# EAGLE design IMU (EAGLE 9.6.2)
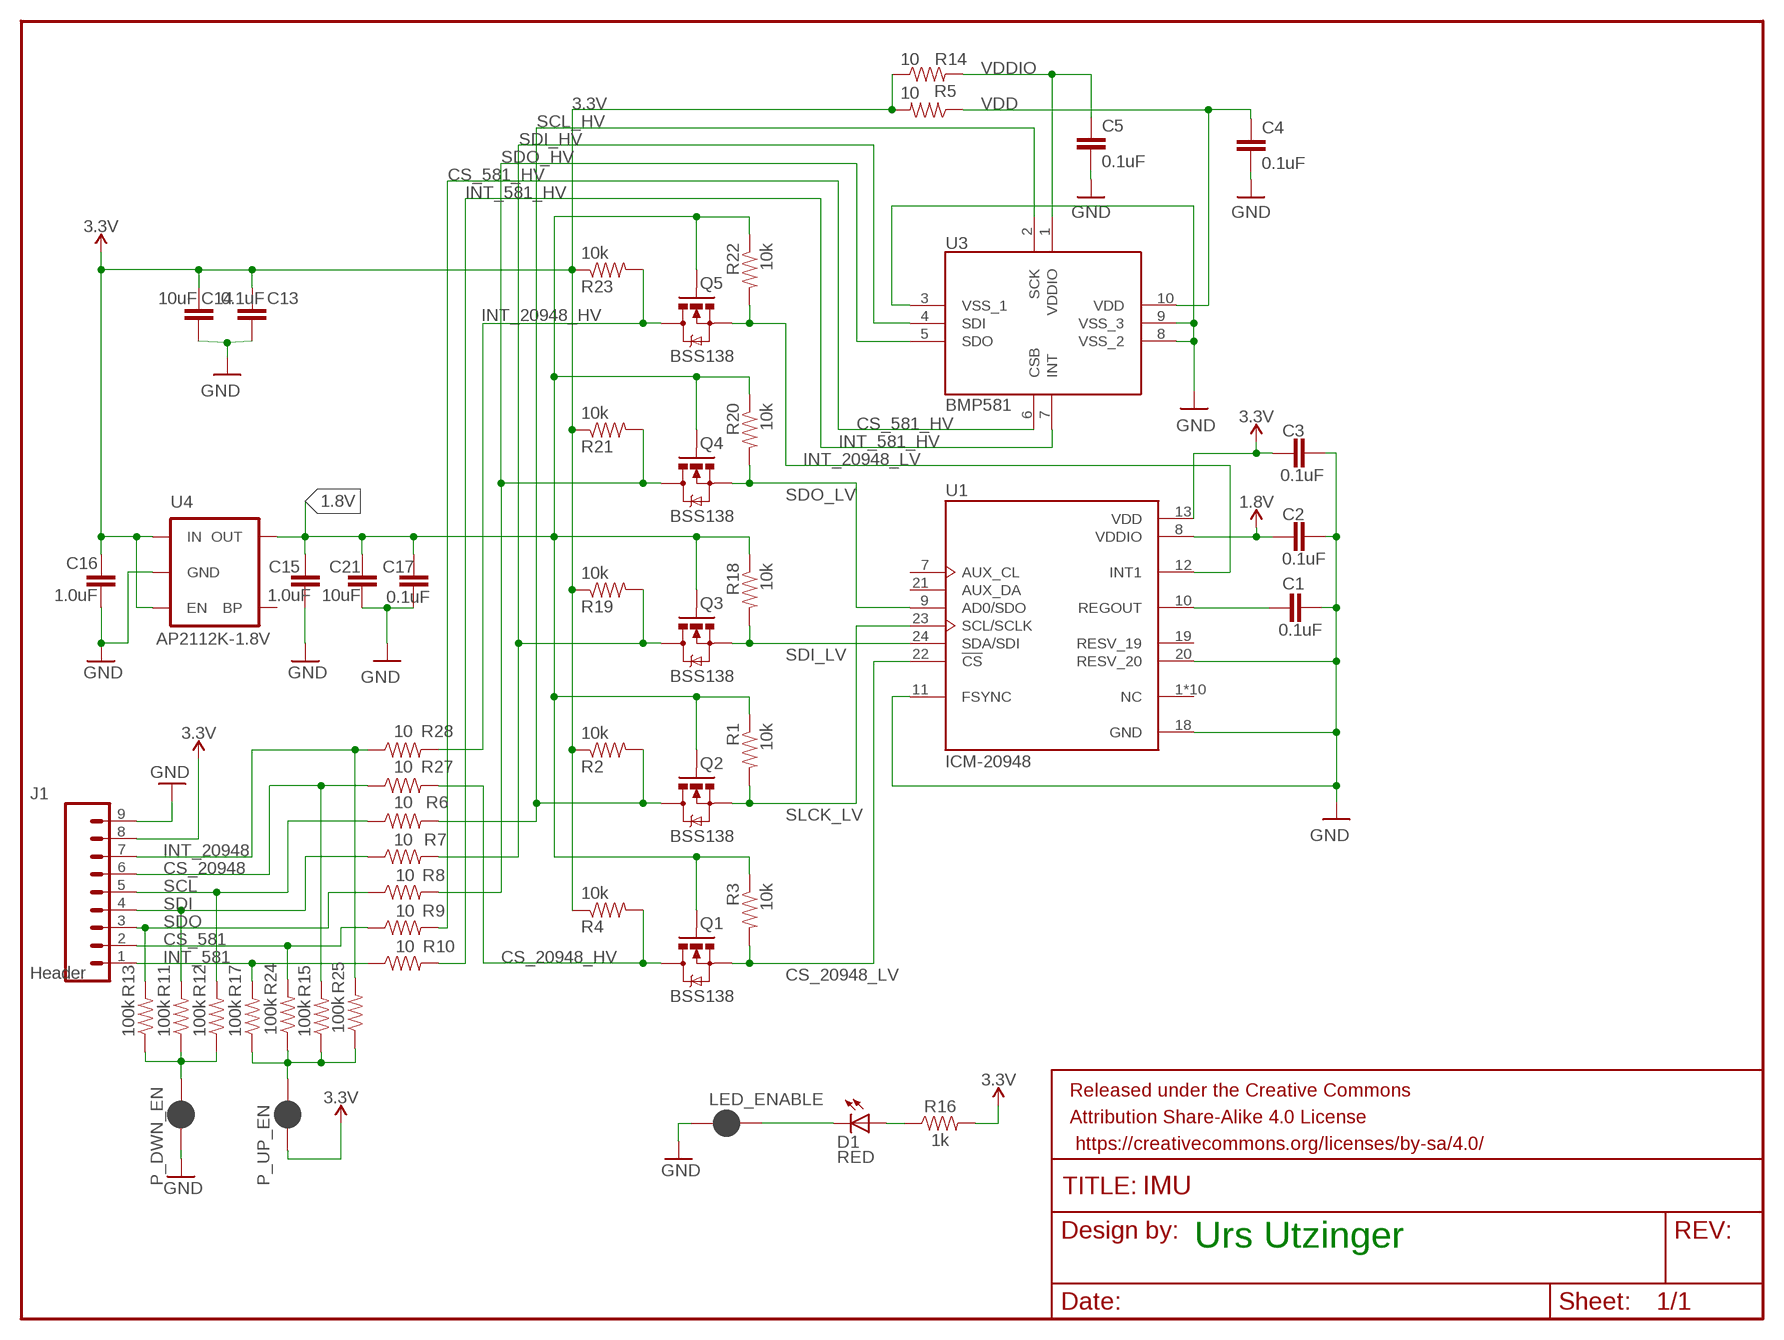
[diagram p0: schematic, sheet 1]

## Parts
C1  0.1uF  0.1UF-0603-25V-(+80/-20%)  [0603]
C2  0.1uF  0.1UF-0603-25V-(+80/-20%)  [0603]
C3  0.1uF  0.1UF-0603-25V-(+80/-20%)  [0603]
C4  0.1uF  0.1UF-0603-25V-(+80/-20%)  [0603]
C5  0.1uF  0.1UF-0603-25V-(+80/-20%)  [0603]
C13  0.1uF  0.1UF-0603-25V-(+80/-20%)  [0603]
C14  10uF  10UF-0603-6.3V-20%  [0603@1]
C15  1.0uF  1.0UF-0603-16V-10%  [0603]
C16  1.0uF  1.0UF-0603-16V-10%  [0603]
C17  0.1uF  0.1UF-0603-25V-(+80/-20%)  [0603]
C21  10uF  10UF-0603-6.3V-20%  [0603@1]
D1  RED  LED-RED0603  [LED-0603]
FRAME1  FRAME-LETTERNO_PACKAGE  [DUMMY]
J1  Header  CONN_09  [1X09]
LED_ENABLE  LED ENABLE  JUMPER-SMT_2_NC_PASTE_SILK  [SMT-JUMPER_2_NC_PASTE_SILK]
P_DWN_EN  JUMPER-SMT_2_NC_PASTE_SILK  [SMT-JUMPER_2_NC_PASTE_SILK]
P_UP_EN  JUMPER-SMT_2_NC_PASTE_SILK  [SMT-JUMPER_2_NC_PASTE_SILK]
Q1  BSS138  SPARKFUN_MOSFET-NCHANNELSMD  [SPARKFUN_SOT23-3]
Q2  BSS138  SPARKFUN_MOSFET-NCHANNELSMD  [SPARKFUN_SOT23-3]
Q3  BSS138  SPARKFUN_MOSFET-NCHANNELSMD  [SPARKFUN_SOT23-3]
Q4  BSS138  SPARKFUN_MOSFET-NCHANNELSMD  [SPARKFUN_SOT23-3]
Q5  BSS138  SPARKFUN_MOSFET-NCHANNELSMD  [SPARKFUN_SOT23-3]
R1  10k  10KOHM-0603-1/10W-1%  [0603]
R2  10k  10KOHM-0603-1/10W-1%  [0603]
R3  10k  10KOHM-0603-1/10W-1%  [0603]
R4  10k  10KOHM-0603-1/10W-1%  [0603]
R5  10  10OHM-0603-1/10W-5%  [0603]
R6  10  10OHM-0603-1/10W-1%  [0603]
R7  10  10OHM-0603-1/10W-1%  [0603]
R8  10  10OHM-0603-1/10W-1%  [0603]
R9  10  10OHM-0603-1/10W-1%  [0603]
R10  10  10OHM-0603-1/10W-1%  [0603]
R11  100k  100KOHM-0603-1/10W-1%  [0603]
R12  100k  100KOHM-0603-1/10W-1%  [0603]
R13  100k  100KOHM-0603-1/10W-1%  [0603]
R14  10  10OHM-0603-1/10W-5%  [0603]
R15  100k  100KOHM-0603-1/10W-1%  [0603]
R16  1k  1KOHM-0603-1/10W-1%  [0603]
R17  100k  100KOHM-0603-1/10W-1%  [0603]
R18  10k  10KOHM-0603-1/10W-1%  [0603]
R19  10k  10KOHM-0603-1/10W-1%  [0603]
R20  10k  10KOHM-0603-1/10W-1%  [0603]
R21  10k  10KOHM-0603-1/10W-1%  [0603]
R22  10k  10KOHM-0603-1/10W-1%  [0603]
R23  10k  10KOHM-0603-1/10W-1%  [0603]
R24  100k  100KOHM-0603-1/10W-1%  [0603]
R25  100k  100KOHM-0603-1/10W-1%  [0603]
R27  10  10OHM-0603-1/10W-1%  [0603]
R28  10  10OHM-0603-1/10W-1%  [0603]
U1  ICM-20948  [QFN40P300X300X105-24N]
U3  BMP581  [BMP581]
U4  AP2112K-1.8V  V_REG_LDOSMD  [SOT23-5]

## Nets
1.8V: C2.1 C15.2 C17.1 C21.1 Q1.1(G) Q2.1(G) Q3.1(G) Q4.1(G) Q5.1(G) R1.1 R3.1 R18.1 R20.1 R22.1 U1.8(VDDIO) U4.5(OUT)
3.3V: C3.1 C13.1 C14.1 C16.2 J1.8 P_UP_EN.1 R2.1 R4.1 R5.2 R14.1 R16.2 R19.1 R21.1 R23.1 U1.13(VDD) U4.1(IN) U4.3(EN)
CS_581: J1.2 R9.1 R24.2
CS_581_HV: R9.2 U3.6(CSB)
CS_20948: J1.6 R15.2 R27.1
CS_20948_HV: Q1.3(D) R4.2 R27.2
CS_20948_LV: Q1.2(S) R3.2 U1.22(!CS)
GND: C1.2 C2.2 C3.2 C4.2 C5.2 C13.2 C14.2 C15.1 C16.1 C17.2 C21.2 J1.9 LED_ENABLE.1 P_DWN_EN.1 U1.11(FSYNC) U1.18(GND) U1.20(RESV_20) U3.3(VSS_1) U3.8(VSS_2) U3.9(VSS_3) U4.2(GND)
INT_581: J1.1 R10.1 R17.2
INT_581_HV: R10.2 U3.7(INT)
INT_20948: J1.7 R25.2 R28.1
INT_20948_HV: Q5.3(D) R23.2 R28.2
INT_20948_LV: Q5.2(S) R22.2 U1.12(INT1)
N$3: C1.1 U1.10(REGOUT)
N$26: D1.A R16.1
N$28: D1.C LED_ENABLE.2
N$29: P_DWN_EN.2 R11.1 R12.1 R13.1
N$30: P_UP_EN.2 R15.1 R17.1 R24.1 R25.1
SCL: J1.5 R6.1 R12.2
SCL_HV: Q2.3(D) R2.2 R6.2 U3.2(SCK)
SDI: J1.4 R7.1 R11.2
SDI_HV: Q3.3(D) R7.2 R19.2 U3.4(SDI)
SDI_LV: Q3.2(S) R18.2 U1.24(SDA/SDI)
SDO: J1.3 R8.1 R13.2
SDO_HV: Q4.3(D) R8.2 R21.2 U3.5(SDO)
SDO_LV: Q4.2(S) R20.2 U1.9(AD0/SDO)
SLCK_LV: Q2.2(S) R1.2 U1.23(SCL/SCLK)
VDD: C4.1 R5.1 U3.10(VDD)
VDDIO: C5.1 R14.2 U3.1(VDDIO)
Unconnected: U1.1(NC) U1.2(NC) U1.3(NC) U1.4(NC) U1.5(NC) U1.6(NC) U1.7(AUX_CL) U1.14(NC) U1.15(NC) U1.16(NC) U1.17(NC) U1.19(RESV_19) U1.21(AUX_DA) U4.4(BP)

## Notes on the sheet
- Urs Utzinger

## Library data of the parts
C1-C5 C13 C17 = SparkFun-Capacitors:0.1UF: 0.1µF ceramic capacitors A capacitor is a passive two-terminal electrical component used to store electrical energy temporarily in an electric field.; PROD_ID: CAP-00810
C14 C21 = SparkFun-Capacitors:10UF: 10.0µF ceramic capacitors A capacitor is a passive two-terminal electrical component used to store electrical energy temporarily in an electric field.; PROD_ID: CAP-11015
C15 C16 = SparkFun-Capacitors:1.0UF: 1µF ceramic capacitors A capacitor is a passive two-terminal electrical component used to store electrical energy temporarily in an electric field.; PROD_ID: CAP-00868
D1 = SparkFun-LED:LED-RED: Assorted Red LEDs LilyPad 1206- DIO-09912 1206- DIO-00809 0603- DIO-00819; PROD_ID: DIO-00819
FRAME1 = SparkFun-Aesthetics:FRAME-LETTER: Schematic Frame - Letter Standard 8.5x11 US Letter frame; DESIGNER: Nobody; VERSION: v01
J1 = SparkFun-Connectors:CONN_09: Multi connection point. Often used as Generic Header-pin footprint for 0.1 inch spaced/style header connections On any of the 0.1 inch spaced packages, you can populate with these: Break Away Headers - Straight <https://www.sparkfun.com/products/116> (PRT-00116) Break Away Male Headers - Right Angle <https://www.sparkfun.com/products/553> (PRT-00553) Female Headers <https://www.sparkfun.com/products/115> (PRT-00115) Break Away Headers - Machine Pin <https://www.sparkfun.com/products/117> (PRT-00117) Break Away Female Headers - Swiss Machine Pin <https://www.sparkfun.com/products/743> (PRT-00743) For SCREWTERMINALS and SPRING TERMINALS visit here: Screw Terimnals on SparkFun.com <https://www.sparkfun.com/search/results?term=Screw+Terminals> (5mm/3.5mm/2.54mm spacing) This device is also useful as a general connection point to wire up your design to another part of your project. Our various solder wires solder well into these plated through hole pads. Hook-Up Wire - Assortment (Stranded, 22 AWG) <https://www.sparkfun.com/products/11375> (PRT-11375) Hook-Up Wire - Assortment (Solid Core, 22 AWG) <https://www.sparkfun.com/products/11367> (PRT-11367) View the entire wire category on our website here <https://www.sparkfun.com/categories/141> Special notes: Molex polarized connector foot print use with SKU : PRT-08231 with associated crimp pins and housings. 1MM SMD Version SKU: PRT-10208 NOTES ON THE VARIANTS LOCK and LOCK_LONGPADS... This footprint was designed to help hold the alignment of a through-hole component (i.e. 6-pin header) while soldering it into place. You may notice that each hole has been shifted either up or down by 0.005 of an inch from it's more standard position (which is a perfectly straight line). This slight alteration caused the pins (the squares in the middle) to touch the edges of the holes. Because they are alternating, it causes a "brace" to hold the component in place. 0.005 has proven to be the perfect amount of "off-center" position when using our standard breakaway headers. Although looks a little odd when you look at the bare footprint, once you have a header in there, the alteration is very hard to notice. Also,if you push a header all the way into place, it is covered up entirely on the bottom side.
LED_ENABLE P_DWN_EN P_UP_EN = SparkFun-Jumpers:JUMPER-SMT_2_NC_PASTE: Normally closed solder jumper This jumper has an aperture in the stencil to allow solder paste to bridge the split in the wire so it's normally closed (NC). Wick off the solder to open the connection. Reapply solder to reclose the connection.
Q1-Q5 = BSS138:SPARKFUN_MOSFET-NCHANNEL
R1-R4 R18-R23 = SparkFun-Resistors:10KOHM: 10kΩ resistor A resistor is a passive two-terminal electrical component that implements electrical resistance as a circuit element. Resistors act to reduce current flow, and, at the same time, act to lower voltage levels within circuits. - Wikipedia; PROD_ID: RES-00824
R5 R14 = SparkFun-Resistors:10OHM: 10Ω resistor A resistor is a passive two-terminal electrical component that implements electrical resistance as a circuit element. Resistors act to reduce current flow, and, at the same time, act to lower voltage levels within circuits. - Wikipedia; PROD_ID: RES-09834
R6-R10 R27 R28 = SparkFun-Resistors:10OHM: 10Ω resistor A resistor is a passive two-terminal electrical component that implements electrical resistance as a circuit element. Resistors act to reduce current flow, and, at the same time, act to lower voltage levels within circuits. - Wikipedia; PROD_ID: RES-12581
R11-R13 R15 R17 R24 R25 = SparkFun-Resistors:100KOHM: 100kΩ resistor A resistor is a passive two-terminal electrical component that implements electrical resistance as a circuit element. Resistors act to reduce current flow, and, at the same time, act to lower voltage levels within circuits. - Wikipedia; PROD_ID: RES-07828
R16 = SparkFun-Resistors:1KOHM: 1kΩ resistor A resistor is a passive two-terminal electrical component that implements electrical resistance as a circuit element. Resistors act to reduce current flow, and, at the same time, act to lower voltage levels within circuits. - Wikipedia; PROD_ID: RES-07856
U1 = ICM-20948:ICM-20948: Accelerometer, Gyroscope, Magnetometer, 9 Axis Sensor I²C, SPI Output; MANUFACTURER: TDK InvenSense; MAXIMUM_PACKAGE_HEIGHT: 1.05 mm; PARTREV: 1.3; STANDARD: IPC 7351B
U3 = BMP581:BMP581: Pressure Sensor 4.35PSI ~ 18.13PSI (30kPa ~ 125kPa) Absolute 10-WFLGA Source: Datasheet <https://www.bosch-sensortec.com/media/boschsensortec/downloads/datasheets/bst-bmp581-ds004.pdf>; DESCRIPTION: Pressure Sensor 4.35PSI ~ 18.13PSI (30kPa ~ 125kPa) Absolute 10-WFLGA; HEIGHT: 0.8mm; MANUFACTURER_NAME: BOSCH; MANUFACTURER_PART_NUMBER: BMP581; MOUSER_PART_NUMBER: 262-BMP581; MOUSER_PRICE-STOCK: https://www.mouser.co.uk/ProductDetail/Bosch-Sensortec/BMP581?qs=Li%252BoUPsLEntPL9tlFmcgXg%3D%3D
U4 = SparkFun-PowerIC:V_REG_LDO: Voltage Regulator LDO Standard 150mA LDO voltage regulator in SOT-23 layout. Micrel part MIC5205. BP (by-pass) pin is used to lower output noise with 470pF cap.; PROD_ID: VREG-12457

## Board
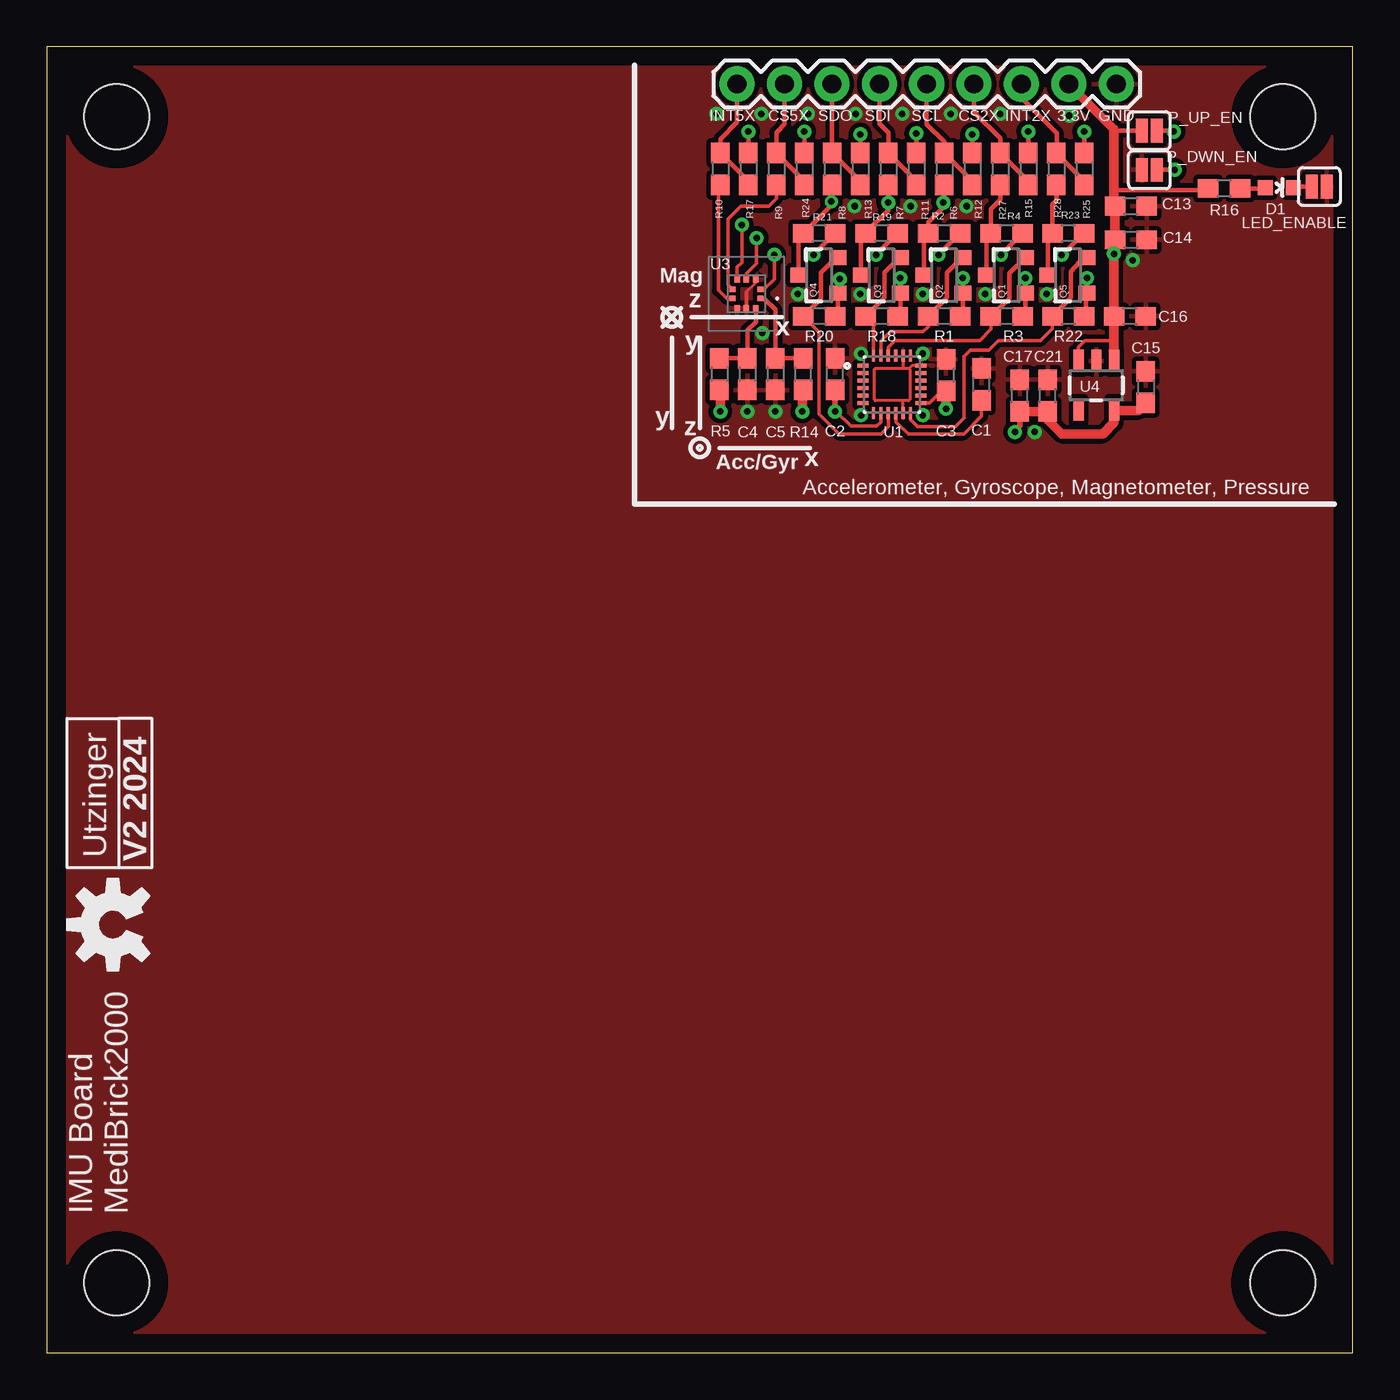
[diagram p1: board, top side]
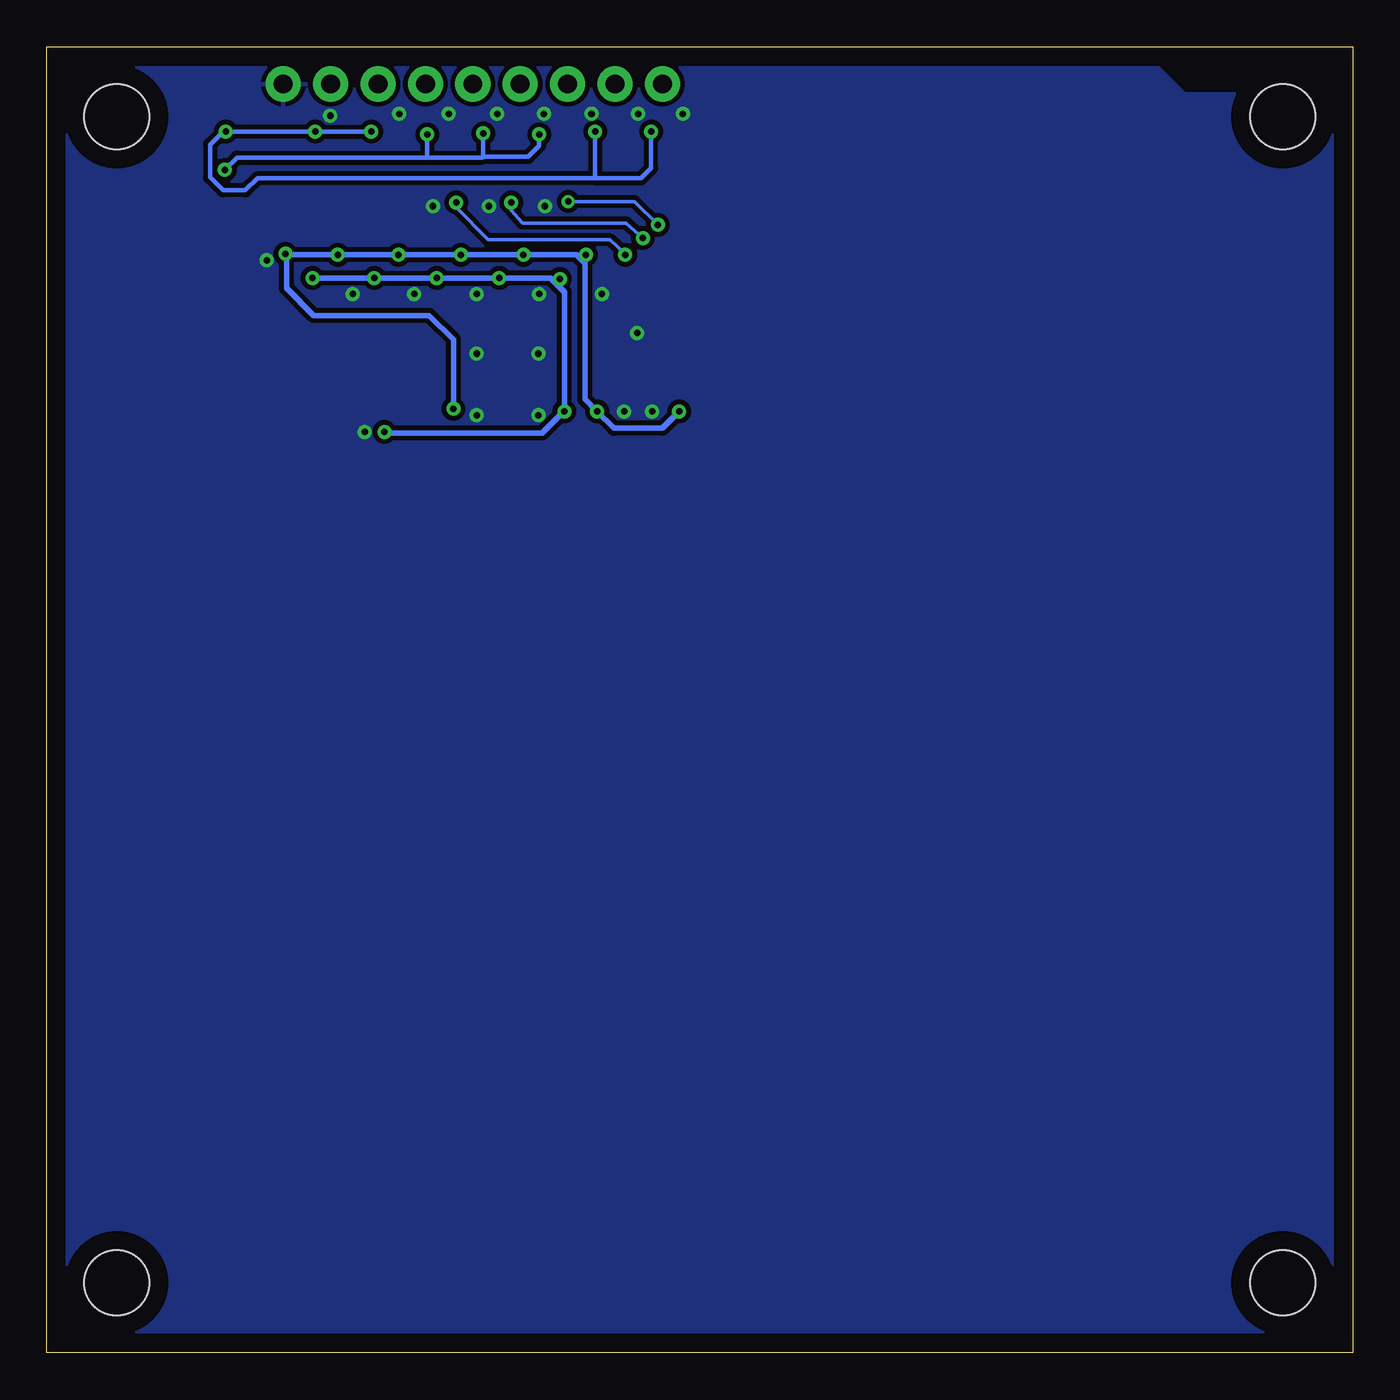
[diagram p2: board, bottom side, seen from below]

Size 70 x 70 mm. Coordinates in mm from the lower left corner, seen from the top.
Outline: 0,0 70,0 70,70 0,70 0,0
Copper layers (1*16): Top 0.035mm / dielectric 1.5mm / Bottom 0.035mm
Design rules "default *": minimum track width 4mil, minimum drill 0.1mm, track to track 6mil, track to pad 3mil, pad to pad 6mil, via to via 3mil, smd to smd 3mil, copper to edge 40mil, drill to drill 6mil, minimum pad ring 3mil, minimum via ring 2mil, stop-mask expansion 3mil, vias tented up to drill 0mil, thermal gap 10mil
Holes 3.5 mm at 3.75,66.25 66.25,66.25 3.75,3.75 66.25,3.75

### Footprints (pad centres in the part's own frame; a part is rotated, then mirrored left to right if it is on the bottom)
0603 = smd 1.1 x 1: 1 -0.85,0; 2 0.85,0
0603@1 = smd 1.1 x 1: 1 -0.85,0; 2 0.85,0
LED-0603 = smd 0.8 x 0.8: A 0,-0.75; C 0,0.75
1X09 = drill 1.016 pad 1.88: 1 0,0; 2 2.54,0; 3 5.08,0; 4 7.62,0; 5 10.16,0; 6 12.7,0; 7 15.24,0; 8 17.78,0; 9 20.32,0
SMT-JUMPER_2_NC_PASTE_SILK = smd 0.635 x 1.27: 1 -0.406,0; 2 0.406,0
SPARKFUN_SOT23-3 = smd 0.8 x 0.9: 1 -0.95,-1; 2 0.95,-1; 3 0,1.1
QFN40P300X300X105-24N = smd 0.64 x 0.22: 1 -1.545,1; 2 -1.545,0.6; 3 -1.545,0.2; 4 -1.545,-0.2; 5 -1.545,-0.6; 6 -1.545,-1; 13 1.545,-1; 14 1.545,-0.6; 15 1.545,-0.2; 16 1.545,0.2; 17 1.545,0.6; 18 1.545,1 | smd 0.22 x 0.64: 7 -1,-1.545; 8 -0.6,-1.545; 9 -0.2,-1.545; 10 0.2,-1.545; 11 0.6,-1.545; 12 1,-1.545; 19 1,1.545; 20 0.6,1.545; 21 0.2,1.545; 22 -0.2,1.545; 23 -0.6,1.545; 24 -1,1.545
BMP581 = smd 0.325 x 0.3: 1 -0.75,0.25; 2 -0.75,-0.25; 6 0.75,-0.25; 7 0.75,0.25 | smd 0.3 x 0.325: 3 -0.5,-0.775; 4 0,-0.775; 5 0.5,-0.775; 8 0.5,0.775; 9 0,0.775; 10 -0.5,0.775
SOT23-5 = smd 0.55 x 1.2: 1 -0.95,-1.3; 2 0,-1.3; 3 0.95,-1.3; 4 0.95,1.3; 5 -0.95,1.3

### Placement (x,y rotation side)
C1  50.1,51.9 90 top
C2  42.25,52.45 90 top
C3  48.2,52.4 90 top
C4  37.55,52.45 270 top
C5  39.05,52.45 270 top
C13  58.1,61.45 0 top
C14  58.1,59.65 0 top
C15  58.9,51.75 270 top
C16  58.05,55.55 180 top
C17  52.15,51.3 90 top
C21  53.65,51.3 90 top
D1  66.05,62.45 270 top
FRAME1  -0.2,0.2 0 top
J1  37,68 0 top
LED_ENABLE  68.2,62.5 180 top
P_DWN_EN  59.09,63.4 0 top
P_UP_EN  59.09,65.5 0 top
Q1  51.45,57.75 90 top
Q2  48.1,57.75 90 top
Q3  44.75,57.75 90 top
Q4  41.4,57.75 90 top
Q5  54.75,57.75 90 top
R1  48.1,55.55 180 top
R2  48.1,60 180 top
R3  51.45,55.55 180 top
R4  51.45,60 180 top
R5  36.05,52.45 270 top
R6  48.1,63.45 270 top
R7  45.1,63.45 270 top
R8  42.1,63.45 270 top
R9  39.1,63.45 270 top
R10  36.1,63.45 270 top
R11  46.6,63.45 270 top
R12  49.6,63.45 270 top
R13  43.6,63.45 270 top
R14  40.55,52.45 90 top
R15  52.6,63.45 270 top
R16  63.1,62.4 180 top
R17  37.6,63.45 270 top
R18  44.75,55.55 180 top
R19  44.75,60 180 top
R20  41.4,55.55 180 top
R21  41.4,60 180 top
R22  54.75,55.55 180 top
R23  54.75,60 180 top
R24  40.6,63.45 270 top
R25  55.6,63.45 270 top
R27  51.1,63.45 270 top
R28  54.1,63.45 270 top
U1  45.3,51.9 0 top
U3  37.5,56.75 180 top
U4  56.25,51.85 180 top
U$1  [OSHW-LOGO-M]  3.55,22.95 90 top

### Tracks (layer width: path | path; a pad name or v marks a point on that pad's centre or on a via)
1.8V  (via drill 0.35 pad 0.75)
  Top 0.2: v42.25,50.45 42.3,50.45 43.1,49.65 44.46,49.65 44.7,49.89 U1.8
  Top 0.254: v52.45,57.6 Q1.1 52.45,55.7 R3.1 | R22.1 55.65,55.6 Q5.1 v55.75,57.6 | v49.1,57.6 Q2.1 49.1,55.7 R1.1 | v45.75,57.6 Q3.1 45.75,55.7 R18.1 | R20.1 42.4,55.7 Q4.1 42.4,57.45 v42.5,57.55
  Top 0.305: 51.9,49.45 52.15,49.7 C17.1 | v42.25,50.45 C2.1
  Top 0.508: C15.2 58.5,50.5 57.25,50.5 U4.5 57.2,49.85 56.6,49.25 54.4,49.25 53.65,50 C21.1 C17.1 | 51.9,49.45 v51.9,49.35
  Bottom 0.305: v55.75,57.6 v52.45,57.6 v49.1,57.6 v45.75,57.6 43,57.6 42.7,57.3 | 42.3,50.45 43.45,49.3 51.85,49.3 v51.9,49.35 | v42.25,50.45 42.25,56.85 42.7,57.3 | v42.5,57.55 42.7,57.35 42.7,57.3
  Bottom 0.508: v42.25,50.45 42.3,50.45
3.3V  (via drill 0.35 pad 0.75)
  Top 0.2: U1.13 47.3,50.9 47.95,51.55 C3.1 | U4.3 55.3,53.9 55.65,54.25 57.2,54.25
  Top 0.254: v51.15,58.85 R4.1 | v54.4,58.85 55.45,59.85 R23.1 | R21.1 v41.1,58.85 | R19.1 v44.45,58.85 | R2.1 v47.8,58.85 | P_UP_EN.1 57.2,65.5 | R16.2 62.16,62.31 57.2,62.31
  Top 0.508: J1.8 57.2,65.58 57.2,65.5 57.2,62.31 57.2,61.5 C13.1 C14.1 57.25,58.95 v57.2,58.9 C16.2 57.2,54.25 U4.1 | v48.2,50.6 C3.1 | v36.1,50.45 36.1,51.55 R5.2 | v40.5,50.45 40.5,51.55 R14.1
  Bottom 0.305: v48.2,50.6 48.2,54.3 49.49,55.59 55.7,55.59 57.15,57.05 57.15,58.85 v54.4,58.85 v51.15,58.85 v47.8,58.85 v44.45,58.85 41.6,58.85 41.35,58.6 | 41.35,58.6 41.15,58.4 41.15,51.1 v40.5,50.45 39.6,49.55 37,49.55 v36.1,50.45 | v41.1,58.85 41.35,58.6
  Bottom 0.508: 57.15,58.85 v57.2,58.9
CS_581
  Top 0.254: J1.2 39.54,65.84 39.1,65.4 R9.1 40.6,62.8 R24.2
CS_581_HV
  Top 0.2: R9.2 39.1,61.85 38.7,61.45 37.2,61.45 36.5,60.75 36.5,57.25 U3.6
CS_20948
  Top 0.2: 52.6,62.8 R15.2
  Top 0.254: J1.6 49.7,66.5 51.1,65.1 R27.1 52.6,62.8
CS_20948_HV
  Top 0.254: Q1.3 50.35,59.5 50.35,59.75 R4.2 50.6,61.3 51.1,61.8 R27.2
CS_20948_LV
  Top 0.2: R3.2 50.6,54.85 50,54.25 45.45,54.25 45.1,53.9 U1.22
  Top 0.254: Q1.2 51.6,57.85 51.6,56.5 R3.2
GND  (via drill 0.35 pad 0.75)
  Top 0.15: U3.3 38,57.36 37.5,56.86 | 45.9,51.03 46.19,51.03 46.25,51.09 46.25,52.71 46.23,52.73 | 45.9,51.03 44.41,51.03 44.35,51.09 44.35,52.71 44.41,52.77 45.9,52.77 | 45.9,52.77 46.19,52.77 46.22,52.74 46.37,52.9 U1.18 | U1.11 45.9,51.03 | U1.20 45.9,52.77
  Top 0.2: U1.20 45.91,53.43 45.91,53.17 | U3.9 37.5,56.86 | U1.18
  other vias: 54.8,66.3 51.1,66.4 48.45,66.4 45.85,66.4 43.35,66.4 40.8,66.4 38.3,66.4 35.9,66.4 50.3,56.75 53.6,56.75 40.25,56.75 43.6,56.75 46.95,56.75 52.95,49.35 46.3,61.45 49.3,61.45 43.3,61.45 43.65,50.25 46.95,50.25 46.95,53.55 43.65,53.55 39.05,50.45 37.55,50.45 58.2,58.55 38.35,54.65
  pour Top (isolate 0.254): 0,70 0,0 70,0 70,70 51.15,70 28,70
  pour Bottom (isolate 0.254): 0,67.5 0,0 70,0 70,70 11.5,70 9,67.5
INT_581
  Top 0.254: J1.1 37,65.95 36.1,65.05 R10.1 37.6,62.8 R17.2
INT_581_HV
  Top 0.2: 36,62.5 36,56.95 36.45,56.5 U3.7
  Top 0.254: R10.2 36,62.5
INT_20948
  Top 0.254: J1.7 52.24,67.26 54.13,65.37 54.13,64.33 R28.1 55.6,62.8 R25.2
INT_20948_HV
  Top 0.254: Q5.3 53.65,59.73 53.64,59.85 R23.2 53.9,61.55 54.1,61.75 R28.2
INT_20948_LV
  Top 0.2: U1.12 46.3,50.01 46.66,49.65 48.7,49.65 49.15,50.1 49.15,53.4 49.5,53.75 50.5,53.75 51,54.25 53.25,54.25 53.9,54.9 R22.2
  Top 0.254: Q5.2 55.55,58.7 54.9,57.95 54.9,56.55 R22.2
N$3
  Top 0.2: U1.10 45.5,49.89 46.18,49.25 49.15,49.25 50.1,50.2 C1.1
N$26
  Top 0.254: 65.25,62.4 R16.1
  Top 0.508: 65.25,62.4 D1.A
N$28
  Top 0.254: LED_ENABLE.2 66.85,62.5
  Top 0.508: 66.85,62.5 D1.C
N$29  (via drill 0.35 pad 0.75)
  Top 0.254: R13.1 v43.6,65.3 | R11.1 v46.6,65.35 | R12.1 v49.6,65.3 | P_DWN_EN.2 v60.45,63.4
  Bottom 0.254: v60.45,63.4 59.8,64.05 49.6,64.05 | 46.6,64.1 44.2,64.1 43.6,64.7 v43.6,65.3 | v46.6,65.35 46.6,64.1 | v49.6,65.3 49.6,64.05 | 49.6,64.05 46.65,64.05 46.6,64.1
N$30  (via drill 0.35 pad 0.75)
  Top 0.254: P_UP_EN.2 60.35,65.5 v60.4,65.45 | R15.1 v52.6,65.45 | R25.1 v55.6,65.45 | R24.1 v40.6,65.45 | R17.1 v37.6,65.45
  Bottom 0.254: v52.6,65.45 v55.6,65.45 v60.4,65.45 60.55,65.45 61.25,64.75 61.25,63 60.55,62.3 59.35,62.3 58.7,62.95 40.6,62.95 | 40.6,62.95 38.15,62.95 37.6,63.5 v37.6,65.45 | v40.6,65.45 40.6,62.95
SCL
  Top 0.254: J1.5 47.16,65.84 48.1,64.9 R6.1 49.6,62.8 R12.2
SCL_HV  (via drill 0.35 pad 0.75)
  Top 0.2: U3.2 38.45,57 39,57.55 v39,58.85
  Top 0.254: Q2.3 47,59.75 R2.2 47.25,60.6 48.05,61.4 v48.05,61.65 48.1,61.7 R6.2
  Bottom 0.2: v39,58.85 39,58.9 39.8,59.65 46.35,59.65 48.05,61.4 v48.05,61.65
SDI
  Top 0.254: J1.4 44.62,65.88 45.1,65.4 R7.1 46.6,62.8 R11.2
SDI_HV  (via drill 0.35 pad 0.75)
  Top 0.2: U3.4 37.5,57.83 38.05,58.38 v38.05,59.75
  Top 0.254: Q3.3 43.65,59.75 R19.2 43.9,60.05 45.1,61.25 v45.1,61.65 R7.2
  Bottom 0.2: v38.05,59.75 38.95,60.55 44.5,60.55 45.1,61.25 v45.1,61.65
SDI_LV
  Top 0.2: U1.24 44.3,55.15 R18.2
  Top 0.254: R18.2 44.9,56.55 44.9,57.9 45.7,58.7 Q3.2
SDO
  Top 0.254: J1.3 42.08,64.32 R8.1 43.6,62.8 R13.2
SDO_HV  (via drill 0.35 pad 0.7, 0.35 pad 0.75)
  Top 0.2: v37.25,60.45 37.25,58.42 37,58.17 U3.5
  Top 0.254: Q4.3 40.3,59.75 R21.2 42.05,61.5 v42.05,61.7 42.05,62.55 R8.2
  Bottom 0.2: v37.25,60.45 38.5,61.7 v42.05,61.7
SDO_LV
  Top 0.2: R20.2 41.4,54.7 41.4,50.3 42.45,49.25 44.71,49.25 45.1,49.64 U1.9
  Top 0.254: R20.2 41.5,56.5 41.5,57.9 42.3,58.7 Q4.2
SLCK_LV
  Top 0.2: U1.23 44.7,54.21 45.22,54.72 46.97,54.72 47.25,55 R1.2
  Top 0.254: R1.2 48.25,56.55 48.25,57.9 49.08,58.73 Q2.2
VDD
  Top 0.254: R5.1 C4.1 37.55,54.8 38,55.25 U3.10
VDDIO
  Top 0.254: U3.1 38.45,56.5 39.05,55.9 C5.1 R14.2

### Text on the board
tPlace: INT5X | CS5X | SDO | SDI | SCL | CS2X | INT2X | 3.3V | GND | Mag | z | y | x | y | z | x | Acc/Gyr | Accelerometer, Gyroscope, Magnetometer, Pressure
tNames: Utzinger | V2 2024 | IMU Board / MediBrick2000